# Altium schematic sheet Logic.SchDoc
size B; Engineer: Soo-Hyun Yoo; Organization: OSURC Aerial; Revision: 4.0; ProjectName: Flight Controller
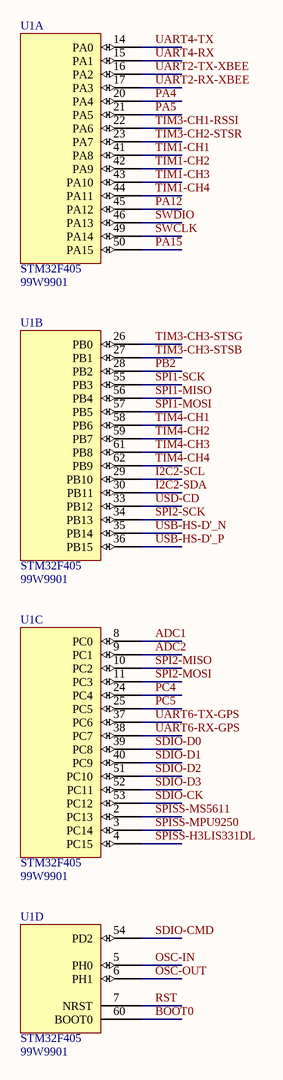
[diagram p0: Logic.SchDoc]

## Parts
U1  STM32F405  Supplier Part Number 1: 99W9901  [LQFP64]  (parts A,B,C,D of 5)

## Nets
ADC1: U1.8(PC0)
ADC2: U1.9(PC1)
BOOT0: U1.60(BOOT0)
I2C2-SCL: U1.29(PB10)
I2C2-SDA: U1.30(PB11)
OSC-IN: U1.5(PH0)
OSC-OUT: U1.6(PH1)
PA4: U1.20(PA4)
PA5: U1.21(PA5)
PA12: U1.45(PA12)
PA15: U1.50(PA15)
PB2: U1.28(PB2)
PC4: U1.24(PC4)
PC5: U1.25(PC5)
RST: U1.7(NRST)
SDIO-CK: U1.53(PC12)
SDIO-CMD: U1.54(PD2)
SDIO-D0: U1.39(PC8)
SDIO-D1: U1.40(PC9)
SDIO-D2: U1.51(PC10)
SDIO-D3: U1.52(PC11)
SPI1-MISO: U1.56(PB4)
SPI1-MOSI: U1.57(PB5)
SPI1-SCK: U1.55(PB3)
SPI2-MISO: U1.10(PC2)
SPI2-MOSI: U1.11(PC3)
SPI2-SCK: U1.34(PB13)
SPISS-H3LIS331DL: U1.4(PC15)
SPISS-MPU9250: U1.3(PC14)
SPISS-MS5611: U1.2(PC13)
SWCLK: U1.49(PA14)
SWDIO: U1.46(PA13)
TIM1-CH1: U1.41(PA8)
TIM1-CH2: U1.42(PA9)
TIM1-CH3: U1.43(PA10)
TIM1-CH4: U1.44(PA11)
TIM3-CH1-RSSI: U1.22(PA6)
TIM3-CH2-STSR: U1.23(PA7)
TIM3-CH3-STSB: U1.27(PB1)
TIM3-CH3-STSG: U1.26(PB0)
TIM4-CH1: U1.58(PB6)
TIM4-CH2: U1.59(PB7)
TIM4-CH3: U1.61(PB8)
TIM4-CH4: U1.62(PB9)
UART2-RX-XBEE: U1.17(PA3)
UART2-TX-XBEE: U1.16(PA2)
UART4-RX: U1.15(PA1)
UART4-TX: U1.14(PA0)
UART6-RX-GPS: U1.38(PC7)
UART6-TX-GPS: U1.37(PC6)
USB-HS-D'_N: U1.35(PB14)
USB-HS-D'_P: U1.36(PB15)
USD-CD: U1.33(PB12)

## Library data of the parts
U1 = STM32F405: Supplier 1: Newark